# EAGLE schematic UHUB (EAGLE 6.2)
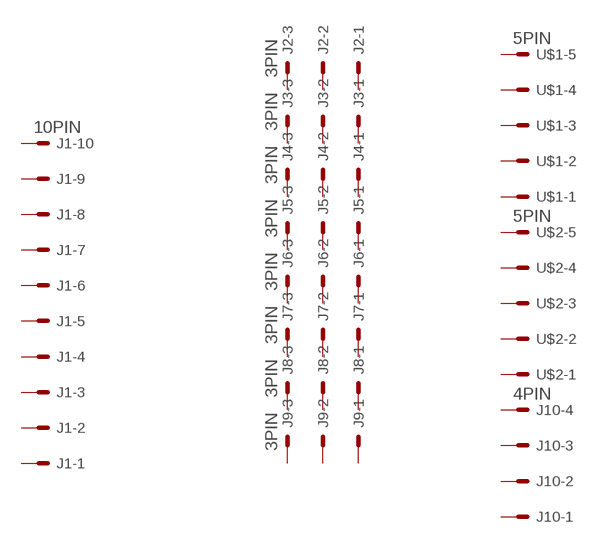
[diagram p0: schematic, sheet 1]

## Parts
J1  10PIN  [5046-10A]
J2  3PIN  [5046-03A]
J3  3PIN  [5046-03A]
J4  3PIN  [5046-03A]
J5  3PIN  [5046-03A]
J6  3PIN  [5046-03A]
J7  3PIN  [5046-03A]
J8  3PIN  [5046-03A]
J9  3PIN  [5046-03A]
J10  4PIN  [5046-04A]
U$1  5PIN  [5046-05A]
U$2  5PIN  [5046-05A]
Unconnected: J1.1 J1.2 J1.3 J1.4 J1.5 J1.6 J1.7 J1.8 J1.9 J1.10 J2.1 J2.2 J2.3 J3.1 J3.2 J3.3 J4.1 J4.2 J4.3 J5.1 J5.2 J5.3 J6.1 J6.2 J6.3 J7.1 J7.2 J7.3 J8.1 J8.2 J8.3 J9.1 J9.2 J9.3 J10.1 J10.2 J10.3 J10.4 U$1.1 U$1.2 U$1.3 U$1.4 U$1.5 U$2.1 U$2.2 U$2.3 U$2.4 U$2.5

## Library data of the parts
J1 = 5051:10PIN
J2-J9 = 5051:3PIN
J10 = 5051:4PIN
U$1 U$2 = 5051:5PIN